# Altium project UZ_CarrierBoard.PrjPcb (part 1 of 10)
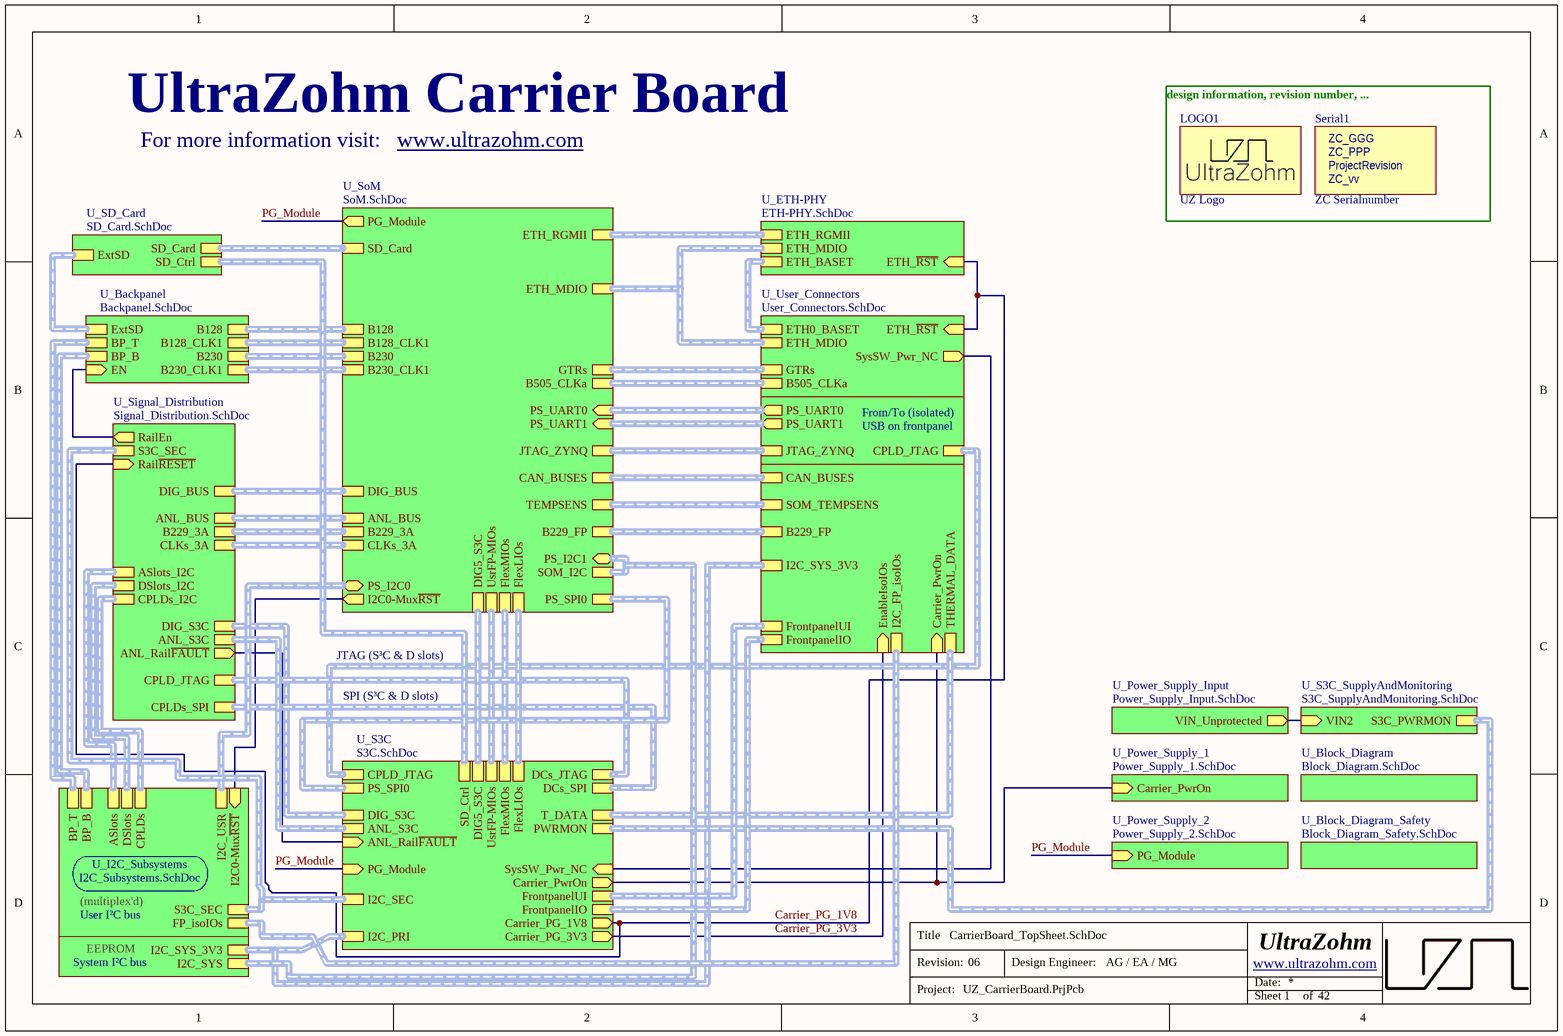
[diagram p0: CarrierBoard_TopSheet.SchDoc]
AuthorParam: AG / EA / MG; Project: UZ_CarrierBoard; ProjectDate: 07/2025; ProjectRevision: 06; Website: www.ultrazohm.com; SheetTotal: 42; Organization: UltraZohm; ZC_GGG: 00[12]; ZC_PPP: 001
42 sheets, 962 parts. Net scope: hierarchical (ports join the sheet entries above them; power ports are global).
Board file: UZ_CarrierBoard.PcbDoc
Sheets:
  CarrierBoard_TopSheet.SchDoc
    U_Signal_Distribution = Signal_Distribution.SchDoc
      DIG1 = Digital_Interface.SchDoc
        U_RP-SlotD = Rail_Protection_AD.SchDoc
      DIG2 = Digital_Interface.SchDoc
        U_RP-SlotD = Rail_Protection_AD.SchDoc
      DIG3 = Digital_Interface.SchDoc
        U_RP-SlotD = Rail_Protection_AD.SchDoc
      DIG4 = Digital_Interface.SchDoc
        U_RP-SlotD = Rail_Protection_AD.SchDoc
      DIG5 = Digital_Interface.SchDoc
        U_RP-SlotD = Rail_Protection_AD.SchDoc
      ANL1 = Analog_Interface.SchDoc
        U_RP-SlotA = Rail_Protection_AD.SchDoc
      ANL2 = Analog_Interface.SchDoc
        U_RP-SlotA = Rail_Protection_AD.SchDoc
      ANL3 = Analog_Interface.SchDoc
        U_RP-SlotA = Rail_Protection_AD.SchDoc
      U_GTH = GTH.SchDoc
      U_DIG_S3C_MCF = DIG_S3C_MultiChannelFunnel.SchDoc
      U_Rail_Shutdown_AD = Rail_Shutdown_AD.SchDoc
      U_ANL_P54_Buffer.SchDoc = ANL_P54_Buffer.SchDoc
    U_SoM = SoM.SchDoc
      U_J1 = J1-3xGTHQ_R+B66.SchDoc
      U_J2 = J2-1xGTHQ_L+1xGTHCLK+GTRQ+2xGTRCLK+4xPLLCLK+CFG+STAT.SchDoc
        U_J2_RefClkAndRTC = J2_RefClkAndRTC.SchDoc
      U_J3 = J3-3xGTHCLK+1xPLLCLK+MIO+B47+B48.SchDoc
      U_J4 = J4-B64+B65.SchDoc
    U_ETH-PHY = ETH-PHY.SchDoc
    U_SD_Card = SD_Card.SchDoc
    U_User_Connectors = User_Connectors.SchDoc
      U_isoDebug = isoDebug.SchDoc
        U_isoDebug-FTDI = isoDebug-FTDI.SchDoc
        U_isoDebug-Isolation = isoDebug-Isolation.SchDoc
      U_Frontpanel = Frontpanel.SchDoc
      U_Thermal = Thermal.SchDoc
      12V_FAN = Power_Supply_TPS54260.SchDoc
    U_Power_Supply_1 = Power_Supply_1.SchDoc
    U_Power_Supply_2 = Power_Supply_2.SchDoc
      1V8_PER = Power_Supply_TPS54260.SchDoc
      1V8_MOD = Power_Supply_TPS54260.SchDoc
    U_Power_Supply_Input = Power_Supply_Input.SchDoc
    U_Block_Diagram = Block_Diagram.SchDoc
    U_S3C = S3C.SchDoc
      U_S3C_IOs3V3 = S3C_IOs3V3.SchDoc
      U_S3C_IOs1V8 = S3C_IOs1V8.SchDoc
      U_S3C_SplitSPI = S3C_SplitSPI.SchDoc
      U_S3C_FrontpanelInterface = S3C_FrontpanelInterface.SchDoc
    U_Block_Diagram_Safety = Block_Diagram_Safety.SchDoc
    U_S3C_SupplyAndMonitoring = S3C_SupplyAndMonitoring.SchDoc
      3V3_S3C = Power_Supply_TPS54260.SchDoc
      U_PwrMon_VIN_10V = Power_Monitoring_TPS3803.SchDoc
      U_PwrMon_VIN_6V = Power_Monitoring_TPS3803.SchDoc
    U_I2C_Subsystems = I2C_Subsystems.SchDoc
      U_I2C0_Mux = I2C0_Mux.SchDoc
    U_Backpanel = Backpanel.SchDoc
      U_Backpanel2T = Backpanel_GigIO.SchDoc
        U_RP-BP = Rail_Protection_BP.SchDoc
      U_Backpanel1B = Backpanel_GigIO.SchDoc
        U_RP-BP = Rail_Protection_BP.SchDoc
      U_Backpanel_SwapMGT4 = Backpanel_SwapMGT4.SchDoc

## Sheet CarrierBoard_TopSheet.SchDoc
size A4; Author: AG / EA / MG; CompanyName: Technische Hochschule Nürnberg Georg Simon Ohm; Organization: UltraZohm; Address1: Kesslerplatz 12; Address2: 90489 Nürnberg; Address3: GERMANY; SheetNumber: 1; Website: www.ultrazohm.com

### Parts
LOGO1  UZ Logo  [UZ_Logo_small]  (no BOM)
Serial1  ZC Serialnumber  [ZC-Serial]  (no BOM)

### Sub-sheets
U_Backpanel = Backpanel.SchDoc: B128 (harness MGT4), B128_CLK1 (harness MGTCLK), B230 (harness MGT4), B230_CLK1 (harness MGTCLK), EN (in), BP_T (harness I2C), BP_B (harness I2C), ExtSD (harness ExtSD)
U_Block_Diagram = Block_Diagram.SchDoc: no entries
U_Block_Diagram_Safety = Block_Diagram_Safety.SchDoc: no entries
U_ETH-PHY = ETH-PHY.SchDoc: ETH_RGMII (harness ETH_RGMII), ETH_MDIO (harness ETH_MDIO), ETH_~{RST} (in), ETH_BASET (harness ETH_BASET)
U_I2C_Subsystems = I2C_Subsystems.SchDoc: I2C_USR (harness I2C), I2C_SYS (harness I2C), I2C_SYS_3V3 (harness I2C), CPLDs (harness I2C), DSlots (harness I2C), ASlots (harness I2C), S3C_SEC (harness I2C), FP_isoIOs (harness I2C), I2C0-Mux~{RST} (in), BP_T (harness I2C), BP_B (harness I2C)
U_Power_Supply_1 = Power_Supply_1.SchDoc: Carrier_PwrOn (in)
U_Power_Supply_2 = Power_Supply_2.SchDoc: PG_Module (in)
U_Power_Supply_Input = Power_Supply_Input.SchDoc: VIN_Unprotected (out)
U_S3C = S3C.SchDoc: DIG_S3C (harness DIG_S3C), PWRMON (harness S3C_PWRMON), CPLD_JTAG (harness JTAG), DCs_JTAG (harness JTAG), DCs_SPI (harness SPI_CPLDs), I2C_PRI (harness I2C), I2C_SEC (harness I2C), FrontpanelUI (harness FrontpanelUI), FlexMIOs (harness FlexMIOs), UsrFP-MIOs (harness UsrFP-MIOs), SysSW_Pwr_NC (in), T_DATA (harness T_DATA), ANL_S3C (harness ANL_S3C), SD_Ctrl (harness SD_Ctrl), PG_Module (in), Carrier_PwrOn (out), FrontpanelIO (harness FrontpanelIO), PS_SPI0 (harness SPI), DIG5_S3C (harness DIG5_S3C), FlexLIOs (harness FlexLIOs), Carrier_PG_3V3 (out), Carrier_PG_1V8 (out), ANL_Rail~{FAULT} (in)
U_S3C_SupplyAndMonitoring = S3C_SupplyAndMonitoring.SchDoc: VIN2 (in), S3C_PWRMON (harness S3C_PWRMON)
U_SD_Card = SD_Card.SchDoc: SD_Card (harness SD_Card), SD_Ctrl (harness SD_Ctrl), ExtSD (harness ExtSD)
U_Signal_Distribution = Signal_Distribution.SchDoc: DIG_BUS (harness DIG_BUS), ANL_BUS (harness ANL_BUS), CPLD_JTAG (harness JTAG), DSlots_I2C (harness I2C), ASlots_I2C (harness I2C), CPLDs_I2C (harness I2C), CPLDs_SPI (harness SPI_CPLDs), DIG_S3C (harness DIG_S3C), ANL_S3C (harness ANL_S3C), ANL_Rail~{FAULT} (out), B229_3A (harness MGT3), CLKs_3A (harness CLKs_3A), RailEn (out), Rail~{RESET} (in), S3C_SEC (harness I2C)
U_SoM = SoM.SchDoc: PS_UART1 (in, harness UART), PS_UART0 (in, harness UART), PS_I2C1 (bidir, harness I2C), PS_I2C0 (bidir, harness I2C), PG_Module (out), DIG_BUS (harness DIG_BUS), ETH_RGMII (harness ETH_RGMII), SD_Card (harness SD_Card), ANL_BUS (harness ANL_BUS), GTRs (harness GTRs), ETH_MDIO (harness ETH_MDIO), JTAG_ZYNQ (harness JTAG), PS_SPI0 (harness SPI), CAN_BUSES (harness CAN_BUSES), SOM_I2C (harness I2C), TEMPSENS (harness T_DIODE), UsrFP-MIOs (harness UsrFP-MIOs), FlexMIOs (harness FlexMIOs), B505_CLKa (harness MGTCLK), DIG5_S3C (harness DIG5_S3C), FlexLIOs (harness FlexLIOs), I2C0-Mux~{RST} (out), B229_3A (harness MGT3), CLKs_3A (harness CLKs_3A), B128 (harness MGT4), B128_CLK1 (harness MGTCLK), B230 (harness MGT4), B230_CLK1 (harness MGTCLK), B229_FP (harness GTH)
U_User_Connectors = User_Connectors.SchDoc: PS_UART0 (out, harness UART), PS_UART1 (out, harness UART), JTAG_ZYNQ (harness JTAG), CAN_BUSES (harness CAN_BUSES), CPLD_JTAG (harness JTAG), GTRs (harness GTRs), ETH0_BASET (harness ETH_BASET), ETH_MDIO (harness ETH_MDIO), SOM_TEMPSENS (harness T_DIODE), I2C_SYS_3V3 (harness I2C), FrontpanelUI (harness FrontpanelUI), SysSW_Pwr_NC (out), B505_CLKa (harness MGTCLK), THERMAL_DATA (harness T_DATA), FrontpanelIO (harness FrontpanelIO), ETH_~{RST} (in), EnableIsoIOs (in), I2C_FP_isoIOs (harness I2C), Carrier_PwrOn (in), B229_FP (harness GTH)

### Nets
ANL_Rail~{FAULT}: sheet U_Signal_Distribution/ANL_Rail~{FAULT}, sheet U_S3C/ANL_Rail~{FAULT}
Carrier_PG_1V8: sheet U_Signal_Distribution/Rail~{RESET}, sheet U_ETH-PHY/ETH_~{RST}, sheet U_User_Connectors/ETH_~{RST}, sheet U_S3C/Carrier_PG_1V8
Carrier_PG_3V3: sheet U_User_Connectors/EnableIsoIOs, sheet U_S3C/Carrier_PG_3V3
Carrier_PwrOn: sheet U_User_Connectors/Carrier_PwrOn, sheet U_Power_Supply_1/Carrier_PwrOn, sheet U_S3C/Carrier_PwrOn
I2C0-Mux~{RST}: sheet U_SoM/I2C0-Mux~{RST}, sheet U_I2C_Subsystems/I2C0-Mux~{RST}
PG_Module: sheet U_SoM/PG_Module, sheet U_Power_Supply_2/PG_Module, sheet U_S3C/PG_Module
RailEn: sheet U_Signal_Distribution/RailEn, sheet U_Backpanel/EN
SysSW_Pwr_NC: sheet U_User_Connectors/SysSW_Pwr_NC, sheet U_S3C/SysSW_Pwr_NC
VIN2: sheet U_Power_Supply_Input/VIN_Unprotected, sheet U_S3C_SupplyAndMonitoring/VIN2

### Buses and harness runs
harness sheet U_Backpanel/B128 = sheet U_SoM/B128
harness sheet U_Backpanel/B128_CLK1 = sheet U_SoM/B128_CLK1
harness sheet U_Backpanel/B230 = sheet U_SoM/B230
harness sheet U_Backpanel/B230_CLK1 = sheet U_SoM/B230_CLK1
harness sheet U_Backpanel/BP_B = sheet U_I2C_Subsystems/BP_B
harness sheet U_Backpanel/BP_T = sheet U_I2C_Subsystems/BP_T
harness sheet U_Backpanel/ExtSD = sheet U_SD_Card/ExtSD
harness sheet U_ETH-PHY/ETH_BASET = sheet U_User_Connectors/ETH0_BASET
harness sheet U_ETH-PHY/ETH_MDIO = sheet U_SoM/ETH_MDIO = sheet U_User_Connectors/ETH_MDIO
harness sheet U_ETH-PHY/ETH_RGMII = sheet U_SoM/ETH_RGMII
harness sheet U_I2C_Subsystems/ASlots = sheet U_Signal_Distribution/ASlots_I2C
harness sheet U_I2C_Subsystems/CPLDs = sheet U_Signal_Distribution/CPLDs_I2C
harness sheet U_I2C_Subsystems/DSlots = sheet U_Signal_Distribution/DSlots_I2C
harness sheet U_I2C_Subsystems/FP_isoIOs = sheet U_User_Connectors/I2C_FP_isoIOs
harness sheet U_I2C_Subsystems/I2C_SYS = sheet U_SoM/PS_I2C1 = sheet U_SoM/SOM_I2C
harness sheet U_I2C_Subsystems/I2C_SYS_3V3 = sheet U_S3C/I2C_PRI = sheet U_User_Connectors/I2C_SYS_3V3
harness sheet U_I2C_Subsystems/I2C_USR = sheet U_SoM/PS_I2C0
harness sheet U_I2C_Subsystems/S3C_SEC = sheet U_S3C/I2C_SEC = sheet U_Signal_Distribution/S3C_SEC
harness sheet U_S3C/ANL_S3C = sheet U_Signal_Distribution/ANL_S3C
harness sheet U_S3C/CPLD_JTAG = sheet U_User_Connectors/CPLD_JTAG
harness sheet U_S3C/DCs_JTAG = sheet U_Signal_Distribution/CPLD_JTAG
harness sheet U_S3C/DCs_SPI = sheet U_Signal_Distribution/CPLDs_SPI
harness sheet U_S3C/DIG5_S3C = sheet U_SoM/DIG5_S3C
harness sheet U_S3C/DIG_S3C = sheet U_Signal_Distribution/DIG_S3C
harness sheet U_S3C/FlexLIOs = sheet U_SoM/FlexLIOs
harness sheet U_S3C/FlexMIOs = sheet U_SoM/FlexMIOs
harness sheet U_S3C/FrontpanelIO = sheet U_User_Connectors/FrontpanelIO
harness sheet U_S3C/FrontpanelUI = sheet U_User_Connectors/FrontpanelUI
harness sheet U_S3C/PS_SPI0 = sheet U_SoM/PS_SPI0
harness sheet U_S3C/PWRMON = sheet U_S3C_SupplyAndMonitoring/S3C_PWRMON
harness sheet U_S3C/SD_Ctrl = sheet U_SD_Card/SD_Ctrl
harness sheet U_S3C/T_DATA = sheet U_User_Connectors/THERMAL_DATA
harness sheet U_S3C/UsrFP-MIOs = sheet U_SoM/UsrFP-MIOs
harness sheet U_SD_Card/SD_Card = sheet U_SoM/SD_Card
harness sheet U_Signal_Distribution/ANL_BUS = sheet U_SoM/ANL_BUS
harness sheet U_Signal_Distribution/B229_3A = sheet U_SoM/B229_3A
harness sheet U_Signal_Distribution/CLKs_3A = sheet U_SoM/CLKs_3A
harness sheet U_Signal_Distribution/DIG_BUS = sheet U_SoM/DIG_BUS
harness sheet U_SoM/B229_FP = sheet U_User_Connectors/B229_FP
harness sheet U_SoM/B505_CLKa = sheet U_User_Connectors/B505_CLKa
harness sheet U_SoM/CAN_BUSES = sheet U_User_Connectors/CAN_BUSES
harness sheet U_SoM/GTRs = sheet U_User_Connectors/GTRs
harness sheet U_SoM/JTAG_ZYNQ = sheet U_User_Connectors/JTAG_ZYNQ
harness sheet U_SoM/PS_UART0 = sheet U_User_Connectors/PS_UART0
harness sheet U_SoM/PS_UART1 = sheet U_User_Connectors/PS_UART1
harness sheet U_SoM/TEMPSENS = sheet U_User_Connectors/SOM_TEMPSENS

### Notes on the sheet
- UltraZohm Carrier Board
- For more information visit:
- www.ultrazohm.com <https://www.ultrazohm.com>
- (near Serial1) design information, revision number, ...
- From/To (isolated)
- USB on frontpanel
- JTAG (S³C & D slots)
- SPI (S³C & D slots)
- (multiplex'd)
- User I²C bus
- System I²C bus
- EEPROM
- Title
- Revision:
- Design Engineer:
- Date:
- Project:
- Sheet
- of
- (in symbol ZC-Serial) ZC_GGG; ZC_PPP; ProjectRevision; ZC_vv

### Library data of the parts
LOGO1 = UZ Logo: UltraZohm Logo on PCB; Created: Jan2021_Liegmann; Value: UZ Logo
Serial1 = ZC-Serial: Manufacturer: UltraZohm; Value: GGG-PPP-VVvv; Created from: FRosner; Manufacturer Part Number: ZC-Serial; PartID: 58; Created On: 15/04/2025 09:17:14; ComponentLink1Description: https://docs.ultrazohm.com/; ComponentLink1URL: homepage; Component Type: ZC Serialnumber; Last Updated: 15/04/2025 09:17:14; Supplier 1: -; Supplier Part Number 1: -; Type: Serial Number; Live Cycle Status: 1

## Sheet Signal_Distribution.SchDoc
size A4; Author: AG / EA / MG; CompanyName: Technische Hochschule Nürnberg Georg Simon Ohm; Organization: UltraZohm; Address1: Kesslerplatz 12; Address2: 90489 Nürnberg; Address3: GERMANY; SheetNumber: 16; Website: www.ultrazohm.com
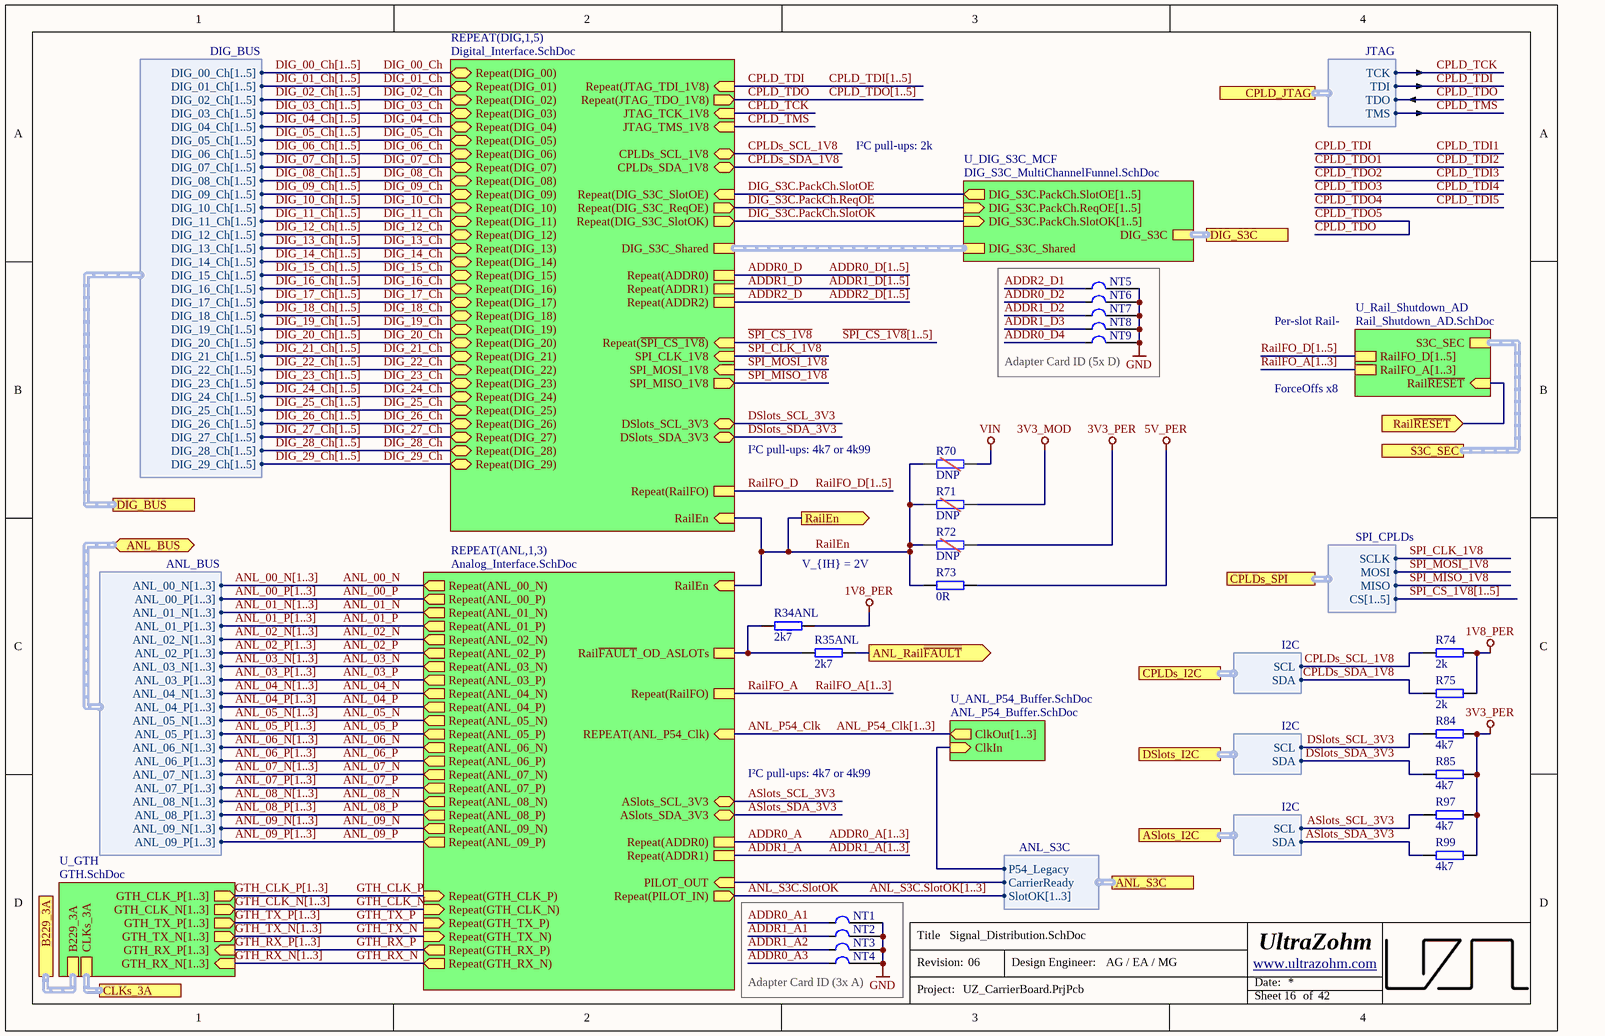
[diagram p1: Signal_Distribution.SchDoc]

### Parts
NT1  Net Tie 1 to 1  [1_to_1_NetTie_0.1mm]  (value not drawn)  (net tie, no BOM)
NT2  Net Tie 1 to 1  [1_to_1_NetTie_0.1mm]  (value not drawn)  (net tie, no BOM)
NT3  Net Tie 1 to 1  [1_to_1_NetTie_0.1mm]  (value not drawn)  (net tie, no BOM)
NT4  Net Tie 1 to 1  [1_to_1_NetTie_0.1mm]  (value not drawn)  (net tie, no BOM)
NT5  Net Tie 1 to 1  [1_to_1_NetTie_0.1mm]  (value not drawn)  (net tie, no BOM)
NT6  Net Tie 1 to 1  [1_to_1_NetTie_0.1mm]  (value not drawn)  (net tie, no BOM)
NT7  Net Tie 1 to 1  [1_to_1_NetTie_0.1mm]  (value not drawn)  (net tie, no BOM)
NT8  Net Tie 1 to 1  [1_to_1_NetTie_0.1mm]  (value not drawn)  (net tie, no BOM)
NT9  Net Tie 1 to 1  [1_to_1_NetTie_0.1mm]  (value not drawn)  (net tie, no BOM)
R34ANL  2k7  [R_0603_TE]
R35ANL  2k7  [R_0603_TE]
R70  DNP  [R_1206_TE-DNP]  (no BOM)
R71  DNP  [R_1206_TE-DNP]  (no BOM)
R72  DNP  [R_1206_TE-DNP]  (no BOM)
R73  0R  [R_1206_TE]
R74  2k  [R_0603_TE]
R75  2k  [R_0603_TE]
R84  4k7  [R_0603_TE]
R85  4k7  [R_0603_TE]
R97  4k7  [R_0603_TE]
R99  4k7  [R_0603_TE]

### Blocks framed on the sheet
Adapter Card ID (5x D): NT5-NT9
Adapter Card ID (3x A): NT1-NT4

### Sub-sheets
REPEAT(ANL,1,3) = Analog_Interface.SchDoc: Repeat(ANL_05_N) (out), Repeat(ANL_07_N) (out), Repeat(ANL_02_N) (out), Repeat(ANL_06_N) (out), Repeat(ANL_08_P) (out), Repeat(ANL_07_P) (out), Repeat(ANL_02_P) (out), Repeat(ANL_01_P) (out), Repeat(ANL_01_N) (out), Repeat(ANL_04_N) (out), Repeat(ANL_05_P) (out), Repeat(ANL_06_P) (out), Repeat(ANL_03_P) (out), Repeat(ANL_03_N) (out), Repeat(ANL_04_P) (out), Repeat(ANL_08_N) (out), PILOT_OUT (in), Repeat(ANL_00_P) (out), Repeat(ANL_09_P) (out), Repeat(PILOT_IN) (out), Repeat(ANL_09_N) (out), Repeat(ANL_00_N) (out), ASlots_SCL_3V3 (bidir), ASlots_SDA_3V3 (bidir), Repeat(GTH_CLK_P) (in), Repeat(GTH_CLK_N) (in), Repeat(GTH_TX_N) (in), Repeat(GTH_TX_P) (in), Repeat(GTH_RX_N) (out), Repeat(GTH_RX_P) (out), RailEn (in), Repeat(ADDR0), Repeat(ADDR1), REPEAT(ANL_P54_Clk) (in), Rail~{FAULT}_OD_ASLOTs, Repeat(RailFO)
REPEAT(DIG,1,5) = Digital_Interface.SchDoc: Repeat(DIG_01) (bidir), Repeat(DIG_03) (bidir), Repeat(DIG_05) (bidir), Repeat(DIG_07) (bidir), Repeat(DIG_09) (bidir), Repeat(DIG_11) (bidir), Repeat(DIG_13) (bidir), Repeat(DIG_15) (bidir), Repeat(DIG_17) (bidir), Repeat(DIG_19) (bidir), Repeat(DIG_21) (bidir), Repeat(DIG_23) (bidir), Repeat(DIG_25) (bidir), Repeat(DIG_27) (bidir), Repeat(DIG_29) (bidir), Repeat(DIG_02) (bidir), Repeat(DIG_04) (bidir), Repeat(DIG_06) (bidir), Repeat(DIG_08) (bidir), Repeat(DIG_10) (bidir), Repeat(DIG_12) (bidir), Repeat(DIG_14) (bidir), Repeat(DIG_16) (bidir), Repeat(DIG_18) (bidir), Repeat(DIG_20) (bidir), Repeat(DIG_22) (bidir), Repeat(DIG_24) (bidir), Repeat(DIG_26) (bidir), Repeat(DIG_28) (bidir), Repeat(DIG_00) (bidir), JTAG_TCK_1V8 (in), JTAG_TMS_1V8 (in), Repeat(JTAG_TDI_1V8) (in), Repeat(JTAG_TDO_1V8) (out), DSlots_SDA_3V3 (bidir), DSlots_SCL_3V3 (bidir), CPLDs_SDA_1V8 (bidir), CPLDs_SCL_1V8 (bidir), DIG_S3C_Shared (harness DIG_S3C_Shared), Repeat(DIG_S3C_SlotOE) (in), Repeat(DIG_S3C_ReqOE) (out), Repeat(~{SPI_CS_1V8}) (in), SPI_CLK_1V8 (in), SPI_MOSI_1V8 (in), SPI_MISO_1V8 (out), Repeat(DIG_S3C_SlotOK) (out), RailEn (in), Repeat(ADDR0), Repeat(ADDR1), Repeat(ADDR2), Repeat(RailFO)
U_ANL_P54_Buffer.SchDoc = ANL_P54_Buffer.SchDoc: ClkOut[1..3] (out), ClkIn (in)
U_DIG_S3C_MCF = DIG_S3C_MultiChannelFunnel.SchDoc: DIG_S3C (harness DIG_S3C), DIG_S3C_Shared (harness DIG_S3C_Shared), DIG_S3C.PackCh.SlotOE[1..5] (out), DIG_S3C.PackCh.ReqOE[1..5] (in), DIG_S3C.PackCh.SlotOK[1..5] (in)
U_GTH = GTH.SchDoc: GTH_CLK_P[1..3] (out), GTH_CLK_N[1..3] (out), GTH_TX_P[1..3] (out), GTH_TX_N[1..3] (out), GTH_RX_P[1..3] (in), GTH_RX_N[1..3] (in), B229_3A (harness MGT3), CLKs_3A (harness CLKs_3A)
U_Rail_Shutdown_AD = Rail_Shutdown_AD.SchDoc: S3C_SEC (harness I2C), Rail~{RESET} (in), RailFO_D[1..5], RailFO_A[1..3]

### Ports
ANL_BUS (bidir, harness ANL_BUS), ANL_Rail~{FAULT} (out), ANL_S3C (harness ANL_S3C), ASlots_I2C (harness I2C), B229_3A (harness MGT3), CLKs_3A (harness CLKs_3A), CPLD_JTAG (harness JTAG), CPLDs_I2C (harness I2C), CPLDs_SPI (harness SPI_CPLDs), DIG_BUS (harness DIG_BUS), DIG_S3C (harness DIG_S3C), DSlots_I2C (harness I2C), RailEn (out), Rail~{RESET} (in), S3C_SEC (harness I2C)

### Harnesses
DIG_BUS: DIG_01_Ch[1..5], DIG_02_Ch[1..5], DIG_03_Ch[1..5], DIG_04_Ch[1..5], DIG_05_Ch[1..5], DIG_06_Ch[1..5], DIG_07_Ch[1..5], DIG_08_Ch[1..5], DIG_09_Ch[1..5], DIG_10_Ch[1..5], DIG_11_Ch[1..5], DIG_12_Ch[1..5], DIG_13_Ch[1..5], DIG_14_Ch[1..5], DIG_15_Ch[1..5], DIG_16_Ch[1..5], DIG_17_Ch[1..5], DIG_18_Ch[1..5], DIG_19_Ch[1..5], DIG_20_Ch[1..5], DIG_21_Ch[1..5], DIG_22_Ch[1..5], DIG_23_Ch[1..5], DIG_24_Ch[1..5], DIG_25_Ch[1..5], DIG_26_Ch[1..5], DIG_27_Ch[1..5], DIG_28_Ch[1..5], DIG_29_Ch[1..5], DIG_00_Ch[1..5]
ANL_BUS: ANL_00_N[1..3], ANL_00_P[1..3], ANL_01_N[1..3], ANL_01_P[1..3], ANL_02_N[1..3], ANL_02_P[1..3], ANL_03_N[1..3], ANL_03_P[1..3], ANL_04_N[1..3], ANL_04_P[1..3], ANL_05_N[1..3], ANL_05_P[1..3], ANL_06_N[1..3], ANL_06_P[1..3], ANL_07_N[1..3], ANL_07_P[1..3], ANL_08_N[1..3], ANL_08_P[1..3], ANL_09_N[1..3], ANL_09_P[1..3]
I2C: SCL, SDA
SPI_CPLDs: SCLK, MOSI, MISO, CS[1..5]
JTAG: TCK, TDI, TDO, TMS
ANL_S3C: CarrierReady, SlotOK[1..3], P54_Legacy

### Nets
1V8_PER: R34ANL.2 R74.2 R75.2
3V3_MOD: R71.2
3V3_PER: R72.2 R84.2 R85.2 R97.2 R99.2
5V_PER: R73.2
GND: NT1.2 NT2.2 NT3.2 NT4.2 NT5.2 NT6.2 NT7.2 NT8.2 NT9.2
VIN: R70.2
ADDR0_A: sheet REPEAT(ANL,1,3)/Repeat(ADDR0)
ADDR0_A1: NT1.1  [project net ADDR0]
ADDR0_A3: NT4.1  [project net ADDR0]
ADDR0_D: sheet REPEAT(DIG,1,5)/Repeat(ADDR0)
ADDR0_D2: NT6.1
ADDR0_D4: NT9.1
ADDR1_A: sheet REPEAT(ANL,1,3)/Repeat(ADDR1)
ADDR1_A1: NT2.1  [project net ADDR1]
ADDR1_A2: NT3.1  [project net ADDR1]
ADDR1_D: sheet REPEAT(DIG,1,5)/Repeat(ADDR1)
ADDR1_D2: NT7.1
ADDR1_D3: NT8.1
ADDR2_D: sheet REPEAT(DIG,1,5)/Repeat(ADDR2)
ADDR2_D1: NT5.1
ANL_00_N: sheet REPEAT(ANL,1,3)/Repeat(ANL_00_N)
ANL_00_P: sheet REPEAT(ANL,1,3)/Repeat(ANL_00_P)
ANL_01_N: sheet REPEAT(ANL,1,3)/Repeat(ANL_01_N)
ANL_01_P: sheet REPEAT(ANL,1,3)/Repeat(ANL_01_P)
ANL_02_N: sheet REPEAT(ANL,1,3)/Repeat(ANL_02_N)
ANL_02_P: sheet REPEAT(ANL,1,3)/Repeat(ANL_02_P)
ANL_03_N: sheet REPEAT(ANL,1,3)/Repeat(ANL_03_N)
ANL_03_P: sheet REPEAT(ANL,1,3)/Repeat(ANL_03_P)
ANL_04_N: sheet REPEAT(ANL,1,3)/Repeat(ANL_04_N)
ANL_04_P: sheet REPEAT(ANL,1,3)/Repeat(ANL_04_P)
ANL_05_N: sheet REPEAT(ANL,1,3)/Repeat(ANL_05_N)
ANL_05_P: sheet REPEAT(ANL,1,3)/Repeat(ANL_05_P)
ANL_06_N: sheet REPEAT(ANL,1,3)/Repeat(ANL_06_N)
ANL_06_P: sheet REPEAT(ANL,1,3)/Repeat(ANL_06_P)
ANL_07_N: sheet REPEAT(ANL,1,3)/Repeat(ANL_07_N)
ANL_07_P: sheet REPEAT(ANL,1,3)/Repeat(ANL_07_P)
ANL_08_N: sheet REPEAT(ANL,1,3)/Repeat(ANL_08_N)
ANL_08_P: sheet REPEAT(ANL,1,3)/Repeat(ANL_08_P)
ANL_09_N: sheet REPEAT(ANL,1,3)/Repeat(ANL_09_N)
ANL_09_P: sheet REPEAT(ANL,1,3)/Repeat(ANL_09_P)
ANL_P54_Clk: sheet REPEAT(ANL,1,3)/REPEAT(ANL_P54_Clk)
ANL_Rail~{FAULT}: R35ANL.2 ; port ANL_Rail~{FAULT}
ANL_S3C.CarrierReady: sheet REPEAT(ANL,1,3)/PILOT_OUT, port ANL_S3C.CarrierReady
ANL_S3C.P54_Legacy: sheet U_ANL_P54_Buffer.SchDoc/ClkIn, port ANL_S3C.P54_Legacy
ANL_S3C.SlotOK: sheet REPEAT(ANL,1,3)/Repeat(PILOT_IN)
ASlots_SCL_3V3: R97.1 ; sheet REPEAT(ANL,1,3)/ASlots_SCL_3V3, port ASlots_I2C.SCL
ASlots_SDA_3V3: R99.1 ; sheet REPEAT(ANL,1,3)/ASlots_SDA_3V3, port ASlots_I2C.SDA
Carrier_PG_1V8: port Rail~{RESET}, sheet U_Rail_Shutdown_AD/Rail~{RESET}
CPLD_TCK: sheet REPEAT(DIG,1,5)/JTAG_TCK_1V8, port CPLD_JTAG.TCK
CPLD_TDI: sheet REPEAT(DIG,1,5)/Repeat(JTAG_TDI_1V8), port CPLD_JTAG.TDI  [also labelled CPLD_TDI1]
CPLD_TDO: sheet REPEAT(DIG,1,5)/Repeat(JTAG_TDO_1V8), port CPLD_JTAG.TDO  [also labelled CPLD_TDO5]
CPLD_TMS: sheet REPEAT(DIG,1,5)/JTAG_TMS_1V8, port CPLD_JTAG.TMS
CPLDs_SCL_1V8: R74.1 ; sheet REPEAT(DIG,1,5)/CPLDs_SCL_1V8, port CPLDs_I2C.SCL
CPLDs_SDA_1V8: R75.1 ; sheet REPEAT(DIG,1,5)/CPLDs_SDA_1V8, port CPLDs_I2C.SDA
DIG_00_Ch: sheet REPEAT(DIG,1,5)/Repeat(DIG_00)
DIG_01_Ch: sheet REPEAT(DIG,1,5)/Repeat(DIG_01)
DIG_02_Ch: sheet REPEAT(DIG,1,5)/Repeat(DIG_02)
DIG_03_Ch: sheet REPEAT(DIG,1,5)/Repeat(DIG_03)
DIG_04_Ch: sheet REPEAT(DIG,1,5)/Repeat(DIG_04)
DIG_05_Ch: sheet REPEAT(DIG,1,5)/Repeat(DIG_05)
DIG_06_Ch: sheet REPEAT(DIG,1,5)/Repeat(DIG_06)
DIG_07_Ch: sheet REPEAT(DIG,1,5)/Repeat(DIG_07)
DIG_08_Ch: sheet REPEAT(DIG,1,5)/Repeat(DIG_08)
DIG_09_Ch: sheet REPEAT(DIG,1,5)/Repeat(DIG_09)
DIG_10_Ch: sheet REPEAT(DIG,1,5)/Repeat(DIG_10)
DIG_11_Ch: sheet REPEAT(DIG,1,5)/Repeat(DIG_11)
DIG_12_Ch: sheet REPEAT(DIG,1,5)/Repeat(DIG_12)
DIG_13_Ch: sheet REPEAT(DIG,1,5)/Repeat(DIG_13)
DIG_14_Ch: sheet REPEAT(DIG,1,5)/Repeat(DIG_14)
DIG_15_Ch: sheet REPEAT(DIG,1,5)/Repeat(DIG_15)
DIG_16_Ch: sheet REPEAT(DIG,1,5)/Repeat(DIG_16)
DIG_17_Ch: sheet REPEAT(DIG,1,5)/Repeat(DIG_17)
DIG_18_Ch: sheet REPEAT(DIG,1,5)/Repeat(DIG_18)
DIG_19_Ch: sheet REPEAT(DIG,1,5)/Repeat(DIG_19)
DIG_20_Ch: sheet REPEAT(DIG,1,5)/Repeat(DIG_20)
DIG_21_Ch: sheet REPEAT(DIG,1,5)/Repeat(DIG_21)
DIG_22_Ch: sheet REPEAT(DIG,1,5)/Repeat(DIG_22)
DIG_23_Ch: sheet REPEAT(DIG,1,5)/Repeat(DIG_23)
DIG_24_Ch: sheet REPEAT(DIG,1,5)/Repeat(DIG_24)
DIG_25_Ch: sheet REPEAT(DIG,1,5)/Repeat(DIG_25)
DIG_26_Ch: sheet REPEAT(DIG,1,5)/Repeat(DIG_26)
DIG_27_Ch: sheet REPEAT(DIG,1,5)/Repeat(DIG_27)
DIG_28_Ch: sheet REPEAT(DIG,1,5)/Repeat(DIG_28)
DIG_29_Ch: sheet REPEAT(DIG,1,5)/Repeat(DIG_29)
DIG_S3C.PackCh.ReqOE: sheet REPEAT(DIG,1,5)/Repeat(DIG_S3C_ReqOE)
DIG_S3C.PackCh.SlotOE: sheet REPEAT(DIG,1,5)/Repeat(DIG_S3C_SlotOE)
DIG_S3C.PackCh.SlotOK: sheet REPEAT(DIG,1,5)/Repeat(DIG_S3C_SlotOK)
DSlots_SCL_3V3: R84.1 ; sheet REPEAT(DIG,1,5)/DSlots_SCL_3V3, port DSlots_I2C.SCL
DSlots_SDA_3V3: R85.1 ; sheet REPEAT(DIG,1,5)/DSlots_SDA_3V3, port DSlots_I2C.SDA
~{FAULT}_OD-: R34ANL.1 R35ANL.1 ; sheet REPEAT(ANL,1,3)/Rail~{FAULT}_OD_ASLOTs
GTH_CLK_N: sheet REPEAT(ANL,1,3)/Repeat(GTH_CLK_N)
GTH_CLK_P: sheet REPEAT(ANL,1,3)/Repeat(GTH_CLK_P)
GTH_RX_N: sheet REPEAT(ANL,1,3)/Repeat(GTH_RX_N)
GTH_RX_P: sheet REPEAT(ANL,1,3)/Repeat(GTH_RX_P)
GTH_TX_N: sheet REPEAT(ANL,1,3)/Repeat(GTH_TX_N)
GTH_TX_P: sheet REPEAT(ANL,1,3)/Repeat(GTH_TX_P)
RailEn: R70.1 R71.1 R72.1 R73.1 ; port RailEn, sheet REPEAT(DIG,1,5)/RailEn, sheet REPEAT(ANL,1,3)/RailEn
RailFO_A: sheet REPEAT(ANL,1,3)/Repeat(RailFO)
RailFO_D: sheet REPEAT(DIG,1,5)/Repeat(RailFO)
~{SPI_CS_1V8}: sheet REPEAT(DIG,1,5)/Repeat(~{SPI_CS_1V8})
SPI_CLK_1V8: sheet REPEAT(DIG,1,5)/SPI_CLK_1V8, port CPLDs_SPI.SCLK  [project net PS_SPI0.CLK]
SPI_MISO_1V8: sheet REPEAT(DIG,1,5)/SPI_MISO_1V8, port CPLDs_SPI.MISO  [project net PS_SPI0.MISO]
SPI_MOSI_1V8: sheet REPEAT(DIG,1,5)/SPI_MOSI_1V8, port CPLDs_SPI.MOSI  [project net PS_SPI0.MOSI]

### Buses and harness runs
bus ADDR0_A[1..3]
bus ADDR0_D[1..5]
bus ADDR1_A[1..3]
bus ADDR1_D[1..5]
bus ADDR2_D[1..5]
bus ANL_00_N[1..3]
bus ANL_00_P[1..3]
bus ANL_01_N[1..3]
bus ANL_01_P[1..3]
bus ANL_02_N[1..3]
bus ANL_02_P[1..3]
bus ANL_03_N[1..3]
bus ANL_03_P[1..3]
bus ANL_04_N[1..3]
bus ANL_04_P[1..3]
bus ANL_05_N[1..3]
bus ANL_05_P[1..3]
bus ANL_06_N[1..3]
bus ANL_06_P[1..3]
bus ANL_07_N[1..3]
bus ANL_07_P[1..3]
bus ANL_08_N[1..3]
bus ANL_08_P[1..3]
bus ANL_09_N[1..3]
bus ANL_09_P[1..3]
bus ANL_P54_Clk[1..3] = sheet U_ANL_P54_Buffer.SchDoc/ClkOut[1..3]
bus ANL_S3C.SlotOK[1..3]
bus CPLD_TDI[1..5]
bus CPLD_TDO[1..5]
bus DIG_00_Ch[1..5]
bus DIG_01_Ch[1..5]
bus DIG_02_Ch[1..5]
bus DIG_03_Ch[1..5]
bus DIG_04_Ch[1..5]
bus DIG_05_Ch[1..5]
bus DIG_06_Ch[1..5]
bus DIG_07_Ch[1..5]
bus DIG_08_Ch[1..5]
bus DIG_09_Ch[1..5]
bus DIG_10_Ch[1..5]
bus DIG_11_Ch[1..5]
bus DIG_12_Ch[1..5]
bus DIG_13_Ch[1..5]
bus DIG_14_Ch[1..5]
bus DIG_15_Ch[1..5]
bus DIG_16_Ch[1..5]
bus DIG_17_Ch[1..5]
bus DIG_18_Ch[1..5]
bus DIG_19_Ch[1..5]
bus DIG_20_Ch[1..5]
bus DIG_21_Ch[1..5]
bus DIG_22_Ch[1..5]
bus DIG_23_Ch[1..5]
bus DIG_24_Ch[1..5]
bus DIG_25_Ch[1..5]
bus DIG_26_Ch[1..5]
bus DIG_27_Ch[1..5]
bus DIG_28_Ch[1..5]
bus DIG_29_Ch[1..5]
bus GTH_CLK_N[1..3] = sheet U_GTH/GTH_CLK_N[1..3]
bus GTH_CLK_P[1..3] = sheet U_GTH/GTH_CLK_P[1..3]
bus GTH_RX_N[1..3] = sheet U_GTH/GTH_RX_N[1..3]
bus GTH_RX_P[1..3] = sheet U_GTH/GTH_RX_P[1..3]
bus GTH_TX_N[1..3] = sheet U_GTH/GTH_TX_N[1..3]
bus GTH_TX_P[1..3] = sheet U_GTH/GTH_TX_P[1..3]
bus RailFO_A[1..3]
bus RailFO_A[1..3] = sheet U_Rail_Shutdown_AD/RailFO_A[1..3]
bus RailFO_D[1..5]
bus RailFO_D[1..5] = sheet U_Rail_Shutdown_AD/RailFO_D[1..5]
bus ~{SPI_CS_1V8}[1..5]
harness port B229_3A = sheet U_GTH/B229_3A
harness port CLKs_3A = sheet U_GTH/CLKs_3A
harness port DIG_S3C = sheet U_DIG_S3C_MCF/DIG_S3C
harness port S3C_SEC = sheet U_Rail_Shutdown_AD/S3C_SEC
harness sheet REPEAT(DIG,1,5)/DIG_S3C_Shared = sheet U_DIG_S3C_MCF/DIG_S3C_Shared

### Notes on the sheet
- I²C pull-ups: 2k
- Per-slot Rail-
- ForceOffs x8
- I²C pull-ups: 4k7 or 4k99
- V_{IH} = 2V
- Title
- Revision:
- Design Engineer:
- Date:
- Project:
- Sheet
- of

### Library data of the parts
NT1-NT9 = Net Tie 1 to 1: Net Tie 1 to 1. Joins two nets without producing a DRC error or renaming one of the nets; PartID: 2; Created On: 29/09/2024 15:25:00; Component Type: Net Tie 1 to 1; Last Updated: 29/09/2024 15:25:00; Type: Net Tie (No BOM); Created by: MGeier; Live Cycle Status: 1
R34ANL R35ANL = UZgen_R_0603_2k7: Generic resistor; Manufacturer: UZgen; Tolerance: 1 %; Created from: UZgenTool; Manufacturer Part Number: UZgen_R_0603_2k7; PartID: 231; Created On: 02/07/2024 17:29:49; Value: 2k7; Device Package: 0603; Mounting Type: SMD; Last Updated: 02/07/2024 17:29:49
R70-R72 = UZgen_R_1206_DNP: Generic resistor (DNP); Manufacturer: UZgen; Created from: UZgenTool; Manufacturer Part Number: UZgen_R_1206_DNP; PartID: 595; Created On: 25/03/2025 14:26:15; Value: DNP; Device Package: 1206; Tolerance: -; Mounting Type: SMD; Last Updated: 02/04/2025 19:05:00
R73 = UZgen_R_1206_0R: Generic resistor; Manufacturer: UZgen; Tolerance: 1 %; Created from: UZgenTool; Manufacturer Part Number: UZgen_R_1206_0R; PartID: 583; Created On: 08/07/2024 14:34:30; Value: 0R; Device Package: 1206; Mounting Type: SMD; Last Updated: 08/07/2024 14:34:30
R74 R75 = UZgen_R_0603_2k: Generic resistor; Manufacturer: UZgen; Tolerance: 1 %; Created from: UZgenTool; Manufacturer Part Number: UZgen_R_0603_2k; PartID: 228; Created On: 02/07/2024 17:29:49; Value: 2k; Device Package: 0603; Mounting Type: SMD; Last Updated: 02/07/2024 17:29:49
R84 R85 R97 R99 = UZgen_R_0603_4k7: Generic resistor; Manufacturer: UZgen; Tolerance: 1 %; Created from: UZgenTool; Manufacturer Part Number: UZgen_R_0603_4k7; PartID: 237; Created On: 02/07/2024 17:29:50; Value: 4k7; Device Package: 0603; Mounting Type: SMD; Last Updated: 02/07/2024 17:29:50

## Sheet Digital_Interface.SchDoc
size A3; Author: AG / EA / MG; CompanyName: Technische Hochschule Nürnberg Georg Simon Ohm; Organization: UltraZohm; Address1: Kesslerplatz 12; Address2: 90489 Nürnberg; Address3: GERMANY; SheetNumber: 21; Website: www.ultrazohm.com
Used 5 times, as channels U_Signal_Distribution/DIG1, U_Signal_Distribution/DIG2, U_Signal_Distribution/DIG3, U_Signal_Distribution/DIG4, U_Signal_Distribution/DIG5. Parts and nets are listed once, with the designators drawn on the sheet.
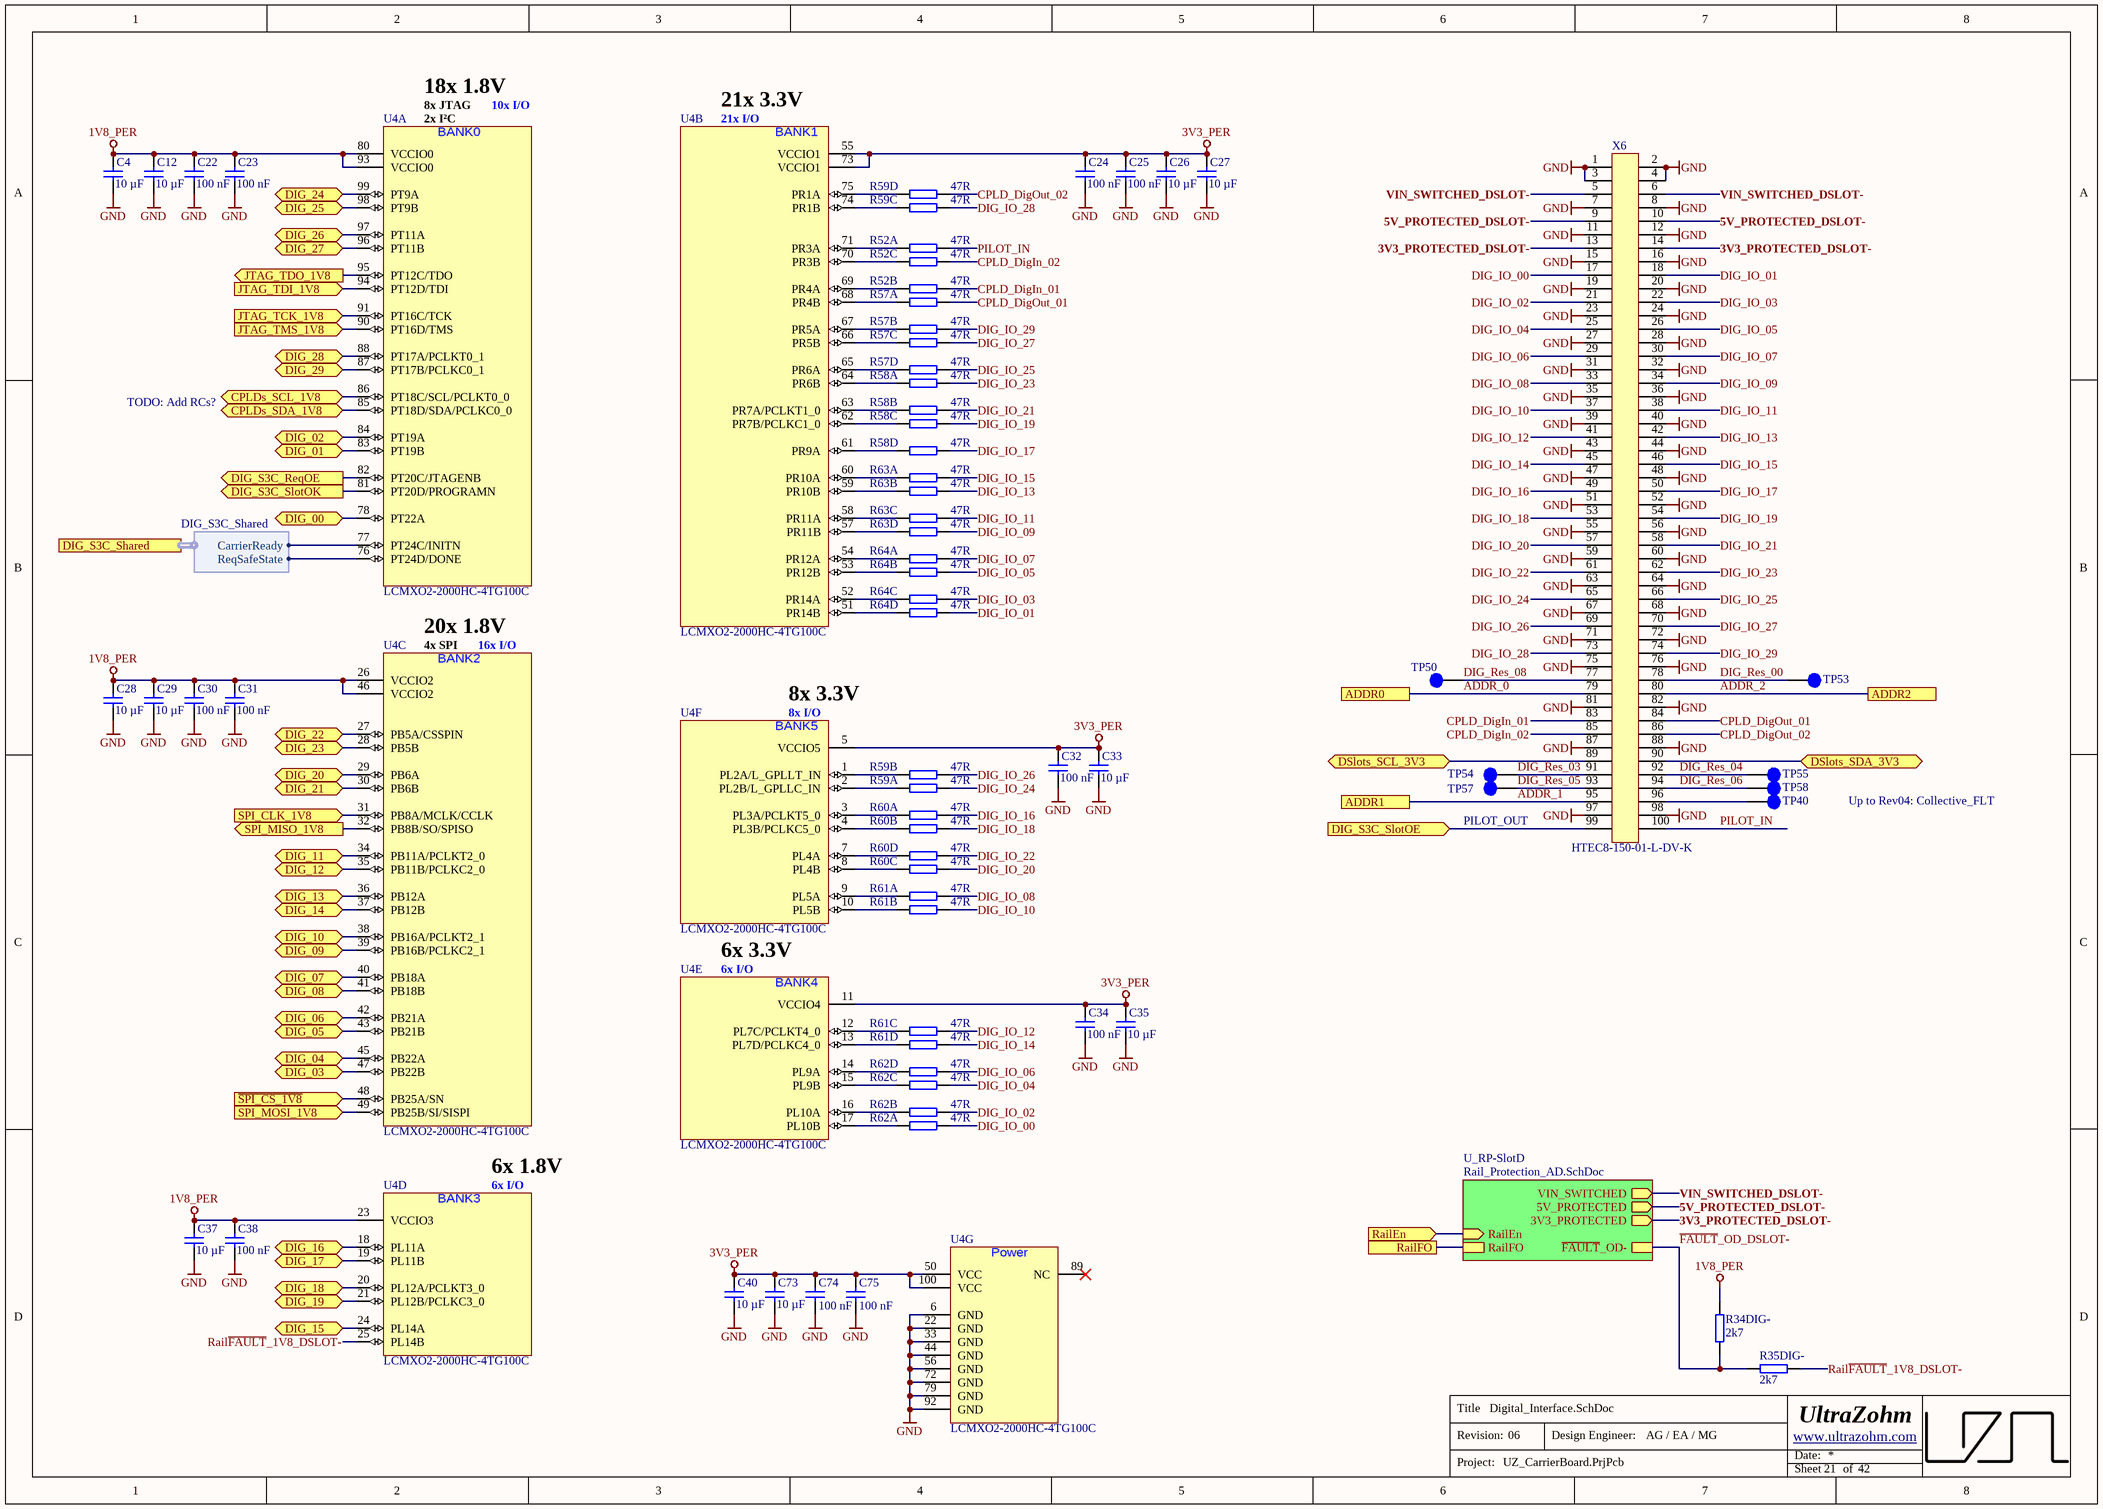
[diagram p2: Digital_Interface.SchDoc]

### Parts
C4  10 µF  [C_0603_TE]
C12  10 µF  [C_0603_TE]
C22  100 nF  [C_0603_TE]
C23  100 nF  [C_0603_TE]
C24  100 nF  [C_0603_TE]
C25  100 nF  [C_0603_TE]
C26  10 µF  [C_0603_TE]
C27  10 µF  [C_0603_TE]
C28  10 µF  [C_0603_TE]
C29  10 µF  [C_0603_TE]
C30  100 nF  [C_0603_TE]
C31  100 nF  [C_0603_TE]
C32  100 nF  [C_0603_TE]
C33  10 µF  [C_0603_TE]
C34  100 nF  [C_0603_TE]
C35  10 µF  [C_0603_TE]
C37  10 µF  [C_0603_TE]
C38  100 nF  [C_0603_TE]
C40  10 µF  [C_0603_TE]
C73  10 µF  [C_0603_TE]
C74  100 nF  [C_0603_TE]
C75  100 nF  [C_0603_TE]
R34DIG-  2k7  [R_0603_TE]
R35DIG-  2k7  [R_0603_TE]
R52  47R  [RESCAV80P160X320X70-8N]  (parts A,B,C of 4)
R57  47R  [RESCAV80P160X320X70-8N]  (parts A,B,C,D of 4)
R58  47R  [RESCAV80P160X320X70-8N]  (parts A,B,C,D of 4)
R59  47R  [RESCAV80P160X320X70-8N]  (parts A,B,C,D of 4)
R60  47R  [RESCAV80P160X320X70-8N]  (parts A,B,C,D of 4)
R61  47R  [RESCAV80P160X320X70-8N]  (parts A,B,C,D of 4)
R62  47R  [RESCAV80P160X320X70-8N]  (parts A,B,C,D of 4)
R63  47R  [RESCAV80P160X320X70-8N]  (parts A,B,C,D of 4)
R64  47R  [RESCAV80P160X320X70-8N]  (parts A,B,C,D of 4)
TP40  Testpoint 1mm  [TP_1mm]  (value not drawn)  (no BOM)
TP50  Testpoint 1mm  [TP_1mm]  (value not drawn)  (no BOM)
TP53  Testpoint 1mm  [TP_1mm]  (value not drawn)  (no BOM)
TP54  Testpoint 1mm  [TP_1mm]  (value not drawn)  (no BOM)
TP55  Testpoint 1mm  [TP_1mm]  (value not drawn)  (no BOM)
TP57  Testpoint 1mm  [TP_1mm]  (value not drawn)  (no BOM)
TP58  Testpoint 1mm  [TP_1mm]  (value not drawn)  (no BOM)
U4  LCMXO2-2000HC-4TG100C  [QFP50P1600X1600X160-100N]  (parts A,B,C,D,E,F,G of 7)
X6  HTEC8-150-01-L-DV-K  [HTEC8-150-XX-X-DV]

### Sub-sheets
U_RP-SlotD = Rail_Protection_AD.SchDoc: RailEn (in), VIN_SWITCHED (out), ~{FAULT}_OD-, 5V_PROTECTED (out), 3V3_PROTECTED (out), RailFO

### Ports
ADDR0, ADDR1, ADDR2, CPLDs_SCL_1V8 (bidir), CPLDs_SDA_1V8 (bidir), DIG_00 (bidir), DIG_01 (bidir), DIG_02 (bidir), DIG_03 (bidir), DIG_04 (bidir), DIG_05 (bidir), DIG_06 (bidir), DIG_07 (bidir), DIG_08 (bidir), DIG_09 (bidir), DIG_10 (bidir), DIG_11 (bidir), DIG_12 (bidir), DIG_13 (bidir), DIG_14 (bidir), DIG_15 (bidir), DIG_16 (bidir), DIG_17 (bidir), DIG_18 (bidir), DIG_19 (bidir), DIG_20 (bidir), DIG_21 (bidir), DIG_22 (bidir), DIG_23 (bidir), DIG_24 (bidir), DIG_25 (bidir), DIG_26 (bidir), DIG_27 (bidir), DIG_28 (bidir), DIG_29 (bidir), DIG_S3C_ReqOE (out), DIG_S3C_Shared (harness DIG_S3C_Shared), DIG_S3C_SlotOE (in), DIG_S3C_SlotOK (out), DSlots_SCL_3V3 (bidir), DSlots_SDA_3V3 (bidir), JTAG_TCK_1V8 (in), JTAG_TDI_1V8 (in), JTAG_TDO_1V8 (out), JTAG_TMS_1V8 (in), RailEn (in), RailFO, SPI_CLK_1V8 (in), SPI_MISO_1V8 (out), SPI_MOSI_1V8 (in), ~{SPI_CS_1V8} (in)

### Harnesses
DIG_S3C_Shared: CarrierReady, ReqSafeState

### Nets
1V8_PER: C4.1 C12.1 C22.2 C23.2 C28.1 C29.1 C30.2 C31.2 C37.1 C38.2 R34DIG-.2 U4.23(VCCIO3) U4.26(VCCIO2) U4.46(VCCIO2) U4.80(VCCIO0) U4.93(VCCIO0)
3V3_PER: C24.2 C25.2 C26.1 C27.1 C32.2 C33.1 C34.2 C35.1 C40.1 C73.1 C74.2 C75.2 U4.5(VCCIO5) U4.11(VCCIO4) U4.50(VCC) U4.55(VCCIO1) U4.73(VCCIO1) U4.100(VCC)
GND: C4.2 C12.2 C22.1 C23.1 C24.1 C25.1 C26.2 C27.2 C28.2 C29.2 C30.1 C31.1 C32.1 C33.2 C34.1 C35.2 C37.2 C38.1 C40.2 C73.2 C74.1 C75.1 U4.6(GND) U4.22(GND) U4.33(GND) U4.44(GND) U4.56(GND) U4.72(GND) U4.79(GND) U4.92(GND) X6.1 X6.2 X6.3 X6.4 X6.7 X6.8 X6.11 X6.12 X6.15 X6.16 X6.19 X6.20 X6.23 X6.24 X6.27 X6.28 X6.31 X6.32 X6.35 X6.36 X6.39 X6.40 X6.43 X6.44 X6.47 X6.48 X6.51 X6.52 X6.55 X6.56 X6.59 X6.60 X6.63 X6.64 X6.67 X6.68 X6.71 X6.72 X6.75 X6.76 X6.81 X6.82 X6.87 X6.88 X6.97 X6.98
3V3_PROTECTED_DSLOT-: X6.13 X6.14 ; sheet U_RP-SlotD/3V3_PROTECTED
5V_PROTECTED_DSLOT-: X6.9 X6.10 ; sheet U_RP-SlotD/5V_PROTECTED
ADDR_0: X6.79 ; port ADDR0
ADDR_1: X6.95 ; port ADDR1
ADDR_2: X6.80 ; port ADDR2
CPLD_DigIn_01: R52.7 X6.83
CPLD_DigIn_02: R52.6 X6.85
CPLD_DigOut_01: R57.8 X6.84
CPLD_DigOut_02: R59.5 X6.86
CPLDs_SCL_1V8: U4.86(PT18C/SCL/PCLKT0_0) ; port CPLDs_SCL_1V8
CPLDs_SDA_1V8: U4.85(PT18D/SDA/PCLKC0_0) ; port CPLDs_SDA_1V8
DIG_00: U4.78(PT22A) ; port DIG_00
DIG_01: U4.83(PT19B) ; port DIG_01
DIG_02: U4.84(PT19A) ; port DIG_02
DIG_03: U4.47(PB22B) ; port DIG_03
DIG_04: U4.45(PB22A) ; port DIG_04
DIG_05: U4.43(PB21B) ; port DIG_05
DIG_06: U4.42(PB21A) ; port DIG_06
DIG_07: U4.40(PB18A) ; port DIG_07
DIG_08: U4.41(PB18B) ; port DIG_08
DIG_09: U4.39(PB16B/PCLKC2_1) ; port DIG_09
DIG_10: U4.38(PB16A/PCLKT2_1) ; port DIG_10
DIG_11: U4.34(PB11A/PCLKT2_0) ; port DIG_11
DIG_12: U4.35(PB11B/PCLKC2_0) ; port DIG_12
DIG_13: U4.36(PB12A) ; port DIG_13
DIG_14: U4.37(PB12B) ; port DIG_14
DIG_15: U4.24(PL14A) ; port DIG_15
DIG_16: U4.18(PL11A) ; port DIG_16
DIG_17: U4.19(PL11B) ; port DIG_17
DIG_18: U4.20(PL12A/PCLKT3_0) ; port DIG_18
DIG_19: U4.21(PL12B/PCLKC3_0) ; port DIG_19
DIG_20: U4.29(PB6A) ; port DIG_20
DIG_21: U4.30(PB6B) ; port DIG_21
DIG_22: U4.27(PB5A/CSSPIN) ; port DIG_22
DIG_23: U4.28(PB5B) ; port DIG_23
DIG_24: U4.99(PT9A) ; port DIG_24
DIG_25: U4.98(PT9B) ; port DIG_25
DIG_26: U4.97(PT11A) ; port DIG_26
DIG_27: U4.96(PT11B) ; port DIG_27
DIG_28: U4.88(PT17A/PCLKT0_1) ; port DIG_28
DIG_29: U4.87(PT17B/PCLKC0_1) ; port DIG_29
DIG_IO_00: R62.8 X6.17
DIG_IO_01: R64.5 X6.18
DIG_IO_02: R62.7 X6.21
DIG_IO_03: R64.6 X6.22
DIG_IO_04: R62.6 X6.25
DIG_IO_05: R64.7 X6.26
DIG_IO_06: R62.5 X6.29
DIG_IO_07: R64.8 X6.30
DIG_IO_08: R61.8 X6.33
DIG_IO_09: R63.5 X6.34
DIG_IO_10: R61.7 X6.37
DIG_IO_11: R63.6 X6.38
DIG_IO_12: R61.6 X6.41
DIG_IO_13: R63.7 X6.42
DIG_IO_14: R61.5 X6.45
DIG_IO_15: R63.8 X6.46
DIG_IO_16: R60.8 X6.49
DIG_IO_17: R58.5 X6.50
DIG_IO_18: R60.7 X6.53
DIG_IO_19: R58.6 X6.54
DIG_IO_20: R60.6 X6.57
DIG_IO_21: R58.7 X6.58
DIG_IO_22: R60.5 X6.61
DIG_IO_23: R58.8 X6.62
DIG_IO_24: R59.8 X6.65
DIG_IO_25: R57.5 X6.66
DIG_IO_26: R59.7 X6.69
DIG_IO_27: R57.6 X6.70
DIG_IO_28: R59.6 X6.73
DIG_IO_29: R57.7 X6.74
DIG_Res_00: TP53.1 X6.78
DIG_Res_03: TP54.1 X6.91
DIG_Res_04: TP55.1 X6.92
DIG_Res_05: TP57.1 X6.93
DIG_Res_06: TP58.1 X6.94
DIG_Res_08: TP50.1 X6.77
DIG_S3C_ReqOE: U4.82(PT20C/JTAGENB) ; port DIG_S3C_ReqOE
DIG_S3C_SlotOE: X6.99 ; port DIG_S3C_SlotOE
DIG_S3C_SlotOK: U4.81(PT20D/PROGRAMN) ; port DIG_S3C_SlotOK
DSlots_SCL_3V3: X6.89 ; port DSlots_SCL_3V3
DSlots_SDA_3V3: X6.90 ; port DSlots_SDA_3V3
~{FAULT}_OD_DSLOT-: R34DIG-.1 R35DIG-.1 ; sheet U_RP-SlotD/~{FAULT}_OD-
JTAG_TCK_1V8: U4.91(PT16C/TCK) ; port JTAG_TCK_1V8
JTAG_TDI_1V8: U4.94(PT12D/TDI) ; port JTAG_TDI_1V8
JTAG_TDO_1V8: U4.95(PT12C/TDO) ; port JTAG_TDO_1V8
JTAG_TMS_1V8: U4.90(PT16D/TMS) ; port JTAG_TMS_1V8
PILOT_IN: R52.8 X6.100
RailEn: port RailEn, sheet U_RP-SlotD/RailEn
Rail~{FAULT}_1V8_DSLOT-: R35DIG-.2 U4.25(PL14B)
RailFO: port RailFO, sheet U_RP-SlotD/RailFO
~{SPI_CS_1V8}: U4.48(PB25A/SN) ; port ~{SPI_CS_1V8}
SPI_CLK_1V8: U4.31(PB8A/MCLK/CCLK) ; port SPI_CLK_1V8
SPI_MISO_1V8: U4.32(PB8B/SO/SPISO) ; port SPI_MISO_1V8
SPI_MOSI_1V8: U4.49(PB25B/SI/SISPI) ; port SPI_MOSI_1V8
VIN_SWITCHED_DSLOT-: X6.5 X6.6 ; sheet U_RP-SlotD/VIN_SWITCHED
NetR52_1: R52.1 U4.71(PR3A)
NetR52_2: R52.2 U4.69(PR4A)
NetR52_3: R52.3 U4.70(PR3B)
NetR57_1: R57.1 U4.68(PR4B)
NetR57_2: R57.2 U4.67(PR5A)
NetR57_3: R57.3 U4.66(PR5B)
NetR57_4: R57.4 U4.65(PR6A)
NetR58_1: R58.1 U4.64(PR6B)
NetR58_2: R58.2 U4.63(PR7A/PCLKT1_0)
NetR58_3: R58.3 U4.62(PR7B/PCLKC1_0)
NetR58_4: R58.4 U4.61(PR9A)
NetR59_1: R59.1 U4.2(PL2B/L_GPLLC_IN)
NetR59_2: R59.2 U4.1(PL2A/L_GPLLT_IN)
NetR59_3: R59.3 U4.74(PR1B)
NetR59_4: R59.4 U4.75(PR1A)
NetR60_1: R60.1 U4.3(PL3A/PCLKT5_0)
NetR60_2: R60.2 U4.4(PL3B/PCLKC5_0)
NetR60_3: R60.3 U4.8(PL4B)
NetR60_4: R60.4 U4.7(PL4A)
NetR61_1: R61.1 U4.9(PL5A)
NetR61_2: R61.2 U4.10(PL5B)
NetR61_3: R61.3 U4.12(PL7C/PCLKT4_0)
NetR61_4: R61.4 U4.13(PL7D/PCLKC4_0)
NetR62_1: R62.1 U4.17(PL10B)
NetR62_2: R62.2 U4.16(PL10A)
NetR62_3: R62.3 U4.15(PL9B)
NetR62_4: R62.4 U4.14(PL9A)
NetR63_1: R63.1 U4.60(PR10A)
NetR63_2: R63.2 U4.59(PR10B)
NetR63_3: R63.3 U4.58(PR11A)
NetR63_4: R63.4 U4.57(PR11B)
NetR64_1: R64.1 U4.54(PR12A)
NetR64_2: R64.2 U4.53(PR12B)
NetR64_3: R64.3 U4.52(PR14A)
NetR64_4: R64.4 U4.51(PR14B)
NetTP40_1: TP40.1 X6.96
NetU4_76: U4.76(PT24D/DONE) ; port DIG_S3C_Shared.ReqSafeState
NetU4_77: U4.77(PT24C/INITN) ; port DIG_S3C_Shared.CarrierReady

Not connected (* = marked no-connect by the designer): U4 89(NC)*

### Channels
U_Signal_Distribution/DIG1: designators end in A; ports ADDR0=ADDR0_D1 ADDR1=ADDR1_D1 ADDR2=ADDR2_D1 CPLDs_SCL_1V8=CPLDs_SCL_1V8 CPLDs_SDA_1V8=CPLDs_SDA_1V8 DIG_00=B65_L7_N DIG_01=B65_L7_P DIG_02=B65_L6_N DIG_03=B65_L6_P DIG_04=B64_L5_P DIG_05=B64_L5_N DIG_06=B65_L10_N DIG_07=B65_L10_P DIG_08=B65_L9_N DIG_09=B65_L9_P DIG_10=B65_L4_N DIG_11=B65_L4_P DIG_12=B65_L14_N DIG_13=B65_L14_P DIG_14=B65_L8_P DIG_15=B65_L8_N DIG_16=B65_L2_N DIG_17=B65_L2_P DIG_18=B65_L3_N DIG_19=B65_L3_P DIG_20=B65_L1_P DIG_21=B65_L1_N DIG_22=B65_L5_P DIG_23=B65_L5_N DIG_24=B64_L24_N DIG_25=B64_L24_P DIG_26=B65_L19_N DIG_27=B65_L19_P DIG_28=B65_L15_N DIG_29=B65_L15_P DIG_S3C_ReqOE=DIG_S3C.PackCh.ReqOE1 DIG_S3C_SlotOE=DIG_S3C.PackCh.SlotOE1 DIG_S3C_SlotOK=DIG_S3C.PackCh.SlotOK1 DSlots_SCL_3V3=DSlots_SCL_3V3 DSlots_SDA_3V3=DSlots_SDA_3V3 JTAG_TCK_1V8=CPLD_TCK JTAG_TDI_1V8=CPLD_TDI JTAG_TDO_1V8=CPLD_TDI2 JTAG_TMS_1V8=CPLD_TMS RailEn=RailEn RailFO=RailFO_D1 SPI_CLK_1V8=PS_SPI0.CLK SPI_MISO_1V8=PS_SPI0.MISO SPI_MOSI_1V8=PS_SPI0.MOSI ~{SPI_CS_1V8}=~{SPI_CS_1V8}1
U_Signal_Distribution/DIG2: designators end in B; ports ADDR0=ADDR0_D2 ADDR1=ADDR1_D2 ADDR2=ADDR2_D2 CPLDs_SCL_1V8=CPLDs_SCL_1V8 CPLDs_SDA_1V8=CPLDs_SDA_1V8 DIG_00=DIG_00_Ch2 DIG_01=DIG_01_Ch2 DIG_02=DIG_02_Ch2 DIG_03=DIG_03_Ch2 DIG_04=DIG_04_Ch2 DIG_05=DIG_05_Ch2 DIG_06=DIG_06_Ch2 DIG_07=DIG_07_Ch2 DIG_08=DIG_08_Ch2 DIG_09=DIG_09_Ch2 DIG_10=DIG_10_Ch2 DIG_11=DIG_11_Ch2 DIG_12=DIG_12_Ch2 DIG_13=DIG_13_Ch2 DIG_14=B65_T3 DIG_15=B65_T2 DIG_16=B65_T1 DIG_17=B65_T0 DIG_18=B65_L24_P DIG_19=B65_L24_N DIG_20=B65_L22_P DIG_21=B65_L22_N DIG_22=B65_L23_N DIG_23=B65_L23_P DIG_24=DIG_24_Ch2 DIG_25=DIG_25_Ch2 DIG_26=DIG_26_Ch2 DIG_27=DIG_27_Ch2 DIG_28=DIG_28_Ch2 DIG_29=DIG_29_Ch2 DIG_S3C_ReqOE=DIG_S3C.PackCh.ReqOE2 DIG_S3C_SlotOE=DIG_S3C.PackCh.SlotOE2 DIG_S3C_SlotOK=DIG_S3C.PackCh.SlotOK2 DSlots_SCL_3V3=DSlots_SCL_3V3 DSlots_SDA_3V3=DSlots_SDA_3V3 JTAG_TCK_1V8=CPLD_TCK JTAG_TDI_1V8=CPLD_TDI2 JTAG_TDO_1V8=CPLD_TDI3 JTAG_TMS_1V8=CPLD_TMS RailEn=RailEn RailFO=RailFO_D2 SPI_CLK_1V8=PS_SPI0.CLK SPI_MISO_1V8=PS_SPI0.MISO SPI_MOSI_1V8=PS_SPI0.MOSI ~{SPI_CS_1V8}=~{SPI_CS_1V8}2
U_Signal_Distribution/DIG3: designators end in C; ports ADDR0=ADDR0_D3 ADDR1=ADDR1_D3 ADDR2=ADDR2_D3 CPLDs_SCL_1V8=CPLDs_SCL_1V8 CPLDs_SDA_1V8=CPLDs_SDA_1V8 DIG_00=DIG_00_Ch3 DIG_01=DIG_01_Ch3 DIG_02=DIG_02_Ch3 DIG_03=DIG_03_Ch3 DIG_04=DIG_04_Ch3 DIG_05=DIG_05_Ch3 DIG_06=DIG_06_Ch3 DIG_07=DIG_07_Ch3 DIG_08=DIG_08_Ch3 DIG_09=DIG_09_Ch3 DIG_10=DIG_10_Ch3 DIG_11=DIG_11_Ch3 DIG_12=DIG_12_Ch3 DIG_13=DIG_13_Ch3 DIG_14=DIG_14_Ch3 DIG_15=DIG_15_Ch3 DIG_16=DIG_16_Ch3 DIG_17=DIG_17_Ch3 DIG_18=DIG_18_Ch3 DIG_19=DIG_19_Ch3 DIG_20=DIG_20_Ch3 DIG_21=DIG_21_Ch3 DIG_22=DIG_22_Ch3 DIG_23=DIG_23_Ch3 DIG_24=DIG_24_Ch3 DIG_25=DIG_25_Ch3 DIG_26=DIG_26_Ch3 DIG_27=DIG_27_Ch3 DIG_28=DIG_28_Ch3 DIG_29=DIG_29_Ch3 DIG_S3C_ReqOE=DIG_S3C.PackCh.ReqOE3 DIG_S3C_SlotOE=DIG_S3C.PackCh.SlotOE3 DIG_S3C_SlotOK=DIG_S3C.PackCh.SlotOK3 DSlots_SCL_3V3=DSlots_SCL_3V3 DSlots_SDA_3V3=DSlots_SDA_3V3 JTAG_TCK_1V8=CPLD_TCK JTAG_TDI_1V8=CPLD_TDI3 JTAG_TDO_1V8=CPLD_TDI4 JTAG_TMS_1V8=CPLD_TMS RailEn=RailEn RailFO=RailFO_D3 SPI_CLK_1V8=PS_SPI0.CLK SPI_MISO_1V8=PS_SPI0.MISO SPI_MOSI_1V8=PS_SPI0.MOSI ~{SPI_CS_1V8}=~{SPI_CS_1V8}3
U_Signal_Distribution/DIG4: designators end in D; ports ADDR0=ADDR0_D4 ADDR1=ADDR1_D4 ADDR2=ADDR2_D4 CPLDs_SCL_1V8=CPLDs_SCL_1V8 CPLDs_SDA_1V8=CPLDs_SDA_1V8 DIG_00=DIG_00_Ch4 DIG_01=DIG_01_Ch4 DIG_02=DIG_02_Ch4 DIG_03=DIG_03_Ch4 DIG_04=DIG_04_Ch4 DIG_05=DIG_05_Ch4 DIG_06=DIG_06_Ch4 DIG_07=DIG_07_Ch4 DIG_08=DIG_08_Ch4 DIG_09=DIG_09_Ch4 DIG_10=DIG_10_Ch4 DIG_11=DIG_11_Ch4 DIG_12=DIG_12_Ch4 DIG_13=DIG_13_Ch4 DIG_14=DIG_14_Ch4 DIG_15=DIG_15_Ch4 DIG_16=DIG_16_Ch4 DIG_17=DIG_17_Ch4 DIG_18=DIG_18_Ch4 DIG_19=DIG_19_Ch4 DIG_20=DIG_20_Ch4 DIG_21=DIG_21_Ch4 DIG_22=DIG_22_Ch4 DIG_23=DIG_23_Ch4 DIG_24=DIG_24_Ch4 DIG_25=DIG_25_Ch4 DIG_26=DIG_26_Ch4 DIG_27=DIG_27_Ch4 DIG_28=DIG_28_Ch4 DIG_29=DIG_29_Ch4 DIG_S3C_ReqOE=DIG_S3C.PackCh.ReqOE4 DIG_S3C_SlotOE=DIG_S3C.PackCh.SlotOE4 DIG_S3C_SlotOK=DIG_S3C.PackCh.SlotOK4 DSlots_SCL_3V3=DSlots_SCL_3V3 DSlots_SDA_3V3=DSlots_SDA_3V3 JTAG_TCK_1V8=CPLD_TCK JTAG_TDI_1V8=CPLD_TDI4 JTAG_TDO_1V8=CPLD_TDI5 JTAG_TMS_1V8=CPLD_TMS RailEn=RailEn RailFO=RailFO_D4 SPI_CLK_1V8=PS_SPI0.CLK SPI_MISO_1V8=PS_SPI0.MISO SPI_MOSI_1V8=PS_SPI0.MOSI ~{SPI_CS_1V8}=~{SPI_CS_1V8}4
U_Signal_Distribution/DIG5: designators end in E; ports ADDR0=ADDR0_D5 ADDR1=ADDR1_D5 ADDR2=ADDR2_D5 CPLDs_SCL_1V8=CPLDs_SCL_1V8 CPLDs_SDA_1V8=CPLDs_SDA_1V8 DIG_00=DIG_00_Ch5 DIG_01=DIG_01_Ch5 DIG_02=DIG_02_Ch5 DIG_03=DIG_03_Ch5 DIG_04=DIG_04_Ch5 DIG_05=DIG_05_Ch5 DIG_06=DIG_06_Ch5 DIG_07=DIG_07_Ch5 DIG_08=DIG_08_Ch5 DIG_09=DIG_09_Ch5 DIG_10=DIG_10_Ch5 DIG_11=DIG_11_Ch5 DIG_12=DIG_12_Ch5 DIG_13=DIG_13_Ch5 DIG_14=DIG_14_Ch5 DIG_15=DIG_15_Ch5 DIG_16=DIG_16_Ch5 DIG_17=DIG_17_Ch5 DIG_18=DIG_18_Ch5 DIG_19=DIG_19_Ch5 DIG_20=DIG_20_Ch5 DIG_21=DIG_21_Ch5 DIG_22=DIG_22_Ch5 DIG_23=DIG_23_Ch5 DIG_24=DIG_24_Ch5 DIG_25=DIG_25_Ch5 DIG_26=DIG_26_Ch5 DIG_27=DIG_27_Ch5 DIG_28=DIG_28_Ch5 DIG_29=DIG_29_Ch5 DIG_S3C_ReqOE=DIG_S3C.PackCh.ReqOE5 DIG_S3C_SlotOE=DIG_S3C.PackCh.SlotOE5 DIG_S3C_SlotOK=DIG_S3C.PackCh.SlotOK5 DSlots_SCL_3V3=DSlots_SCL_3V3 DSlots_SDA_3V3=DSlots_SDA_3V3 JTAG_TCK_1V8=CPLD_TCK JTAG_TDI_1V8=CPLD_TDI5 JTAG_TDO_1V8=CPLD_TDO JTAG_TMS_1V8=CPLD_TMS RailEn=RailEn RailFO=RailFO_D5 SPI_CLK_1V8=PS_SPI0.CLK SPI_MISO_1V8=PS_SPI0.MISO SPI_MOSI_1V8=PS_SPI0.MOSI ~{SPI_CS_1V8}=~{SPI_CS_1V8}5

### Notes on the sheet
- 18x 1.8V
- 8x JTAG
- 10x I/O
- (near U4) 21x 3.3V
- (near U4) 2x I²C
- 21x I/O
- TODO: Add RCs?
- 20x 1.8V
- (near U4) 4x SPI
- 16x I/O
- 8x 3.3V
- (near U4) 8x I/O
- PILOT_OUT
- Up to Rev04: Collective_FLT
- (near U4) 6x 3.3V
- 6x I/O
- (near U4) 6x 1.8V
- Title
- Revision:
- Design Engineer:
- Date:
- Project:
- Sheet
- of
- (in symbol LCMXO2-2000HC-4TG100C, part A) BANK0
- (in symbol LCMXO2-2000HC-4TG100C, part B) BANK1
- (in symbol LCMXO2-2000HC-4TG100C, part C) BANK2
- (in symbol LCMXO2-2000HC-4TG100C, part D) BANK3
- (in symbol LCMXO2-2000HC-4TG100C, part E) BANK4
- (in symbol LCMXO2-2000HC-4TG100C, part F) BANK5
- (in symbol LCMXO2-2000HC-4TG100C, part G) Power

### Library data of the parts
C4 C12 C26-C29 C33 C35 C37 C40 C73 = UZgen_C_0603_10uF_6.3V_X7R: Generic capacitor; Manufacturer: UZgen; Voltage: 6.3V; Tolerance: 10 %; Created from: UZgenTool; Manufacturer Part Number: UZgen_C_0603_10uF_6.3V_X7R; PartID: 3631; Created On: 02.08.2024 11:17:55; Value: 10 µF; Device Package: 0603; Technology: X7R; Mounting Type: SMD; Last Updated: 02.08.2024 11:17:55
C22-C25 C30-C32 C34 C38 C74 C75 = UZgen_C_0603_100nF_50V_X7R: Generic capacitor; Manufacturer: UZgen; Tolerance: 10 %; Voltage: 50 V; Created from: AGeiger; Value: 100 nF; Technology: X7R; Manufacturer Part Number: UZgen_C_0603_100nF_50V_X7R; PartID: 1; Created On: 02/07/2024 14:42:23; Device Package: 0603; Mounting Type: SMD; Last Updated: 02/08/2024 14:45:57
R34DIG- R35DIG- = UZgen_R_0603_2k7: as R34ANL on sheet Signal_Distribution; Manufacturer Part Number: UZgen_R_0603_2k7; PartID: 231; Created On: 02/07/2024 17:29:49; Value: 2k7; Device Package: 0603; Mounting Type: SMD; Last Updated: 02/07/2024 17:29:49
R52 R57-R64 = CAY16-470J4LF: Resistor Networks & Arrays 47ohm 5% Convex 4resistors; Manufacturer: Bourns; Created from: AGeiger; Manufacturer Part Number: CAY16-470J4LF; PartID: 342; Created On: 06.08.2024 10:26:57; ComponentLink1Description: Datasheet; ComponentLink1URL: https://www.mouser.de/datasheet/2/54/CATCAY-777361.pdf; Component Type: SMD resistor array; Device Package: 1206; Last Updated: 06.08.2024 10:26:57; Mounting Type: SMD; Supplier 1: Mouser; Supplier Part Number 1: 652-CAY16-470J4LF; Supplier 2: LCSC; Supplier Part Number 2: C16081; Type: Resistor Array; Tolerance: 5%; Value: 47R; Live Cycle Status: 1; Stock number: not stored; LCSC Part Number: C16081
TP40 TP50 TP53-TP55 TP57 TP58 = NULL: Manufacturer Part Number: NULL; Created from: AGeiger; Created: 2018_06_25_AGeiger; Value: Testpoint 1mm; PartID: 9; Component Type: Testpoint; Manufacturer: NULL; Supplier 1: NULL; Supplier Part Number 1: NULL; Type: Testpoint; Live Cycle Status: 1
  TP40: Created On: 20/09/2022 13:14:57; Last Updated: 20/09/2022 13:15:39
  TP50 TP53-TP55 TP57 TP58: Created On: 20.09.2022 13:14:57; Last Updated: 20.09.2022 13:15:39
U4 = LCMXO2-2000HC-4TG100C: TQFP-100(14x14) Programmable Logic Device (CPLDs/FPGAs) ROHS; Manufacturer: Lattice; Created from: FRosner; Manufacturer Part Number: LCMXO2-2000HC-4TG100C; PartID: 37; Created On: 03.07.2024 17:33:36; ComponentLink1Description: Datasheet; ComponentLink1URL: https://wmsc.lcsc.com/wmsc/upload/file/pdf/v2/lcsc/2403111456_Lattice-LCMXO2-2000HC-4TG100C_C1521632.pdf; Component Type: CPLD; Device Package: SMD; Last Updated: 03.07.2024 17:33:36; Mounting Type: SMD; Operating Temperature: -0°C - +85°C; Supplier 1: LCSC; Supplier Part Number 1: C1521632; Supplier 2: Mouser; Supplier Part Number 2: 842-XO22000HC4TG100C; Type: CPLD; Live Cycle Status: 1; LCSC Part Number: C1521632; Stock number: not stored
X6 = HTEC8-150-01-L-DV-K: HTEC8-150-01-L-DV-K mating connector for card layout; Manufacturer: SAMTEC; Created from: MGremer; Number of positions: 100; Manufacturer Part Number: HTEC8-150-01-L-DV-K; PartID: 7; Created On: 26.02.2021 16:36:12; ComponentLink1Description: Homepage; ComponentLink1URL: https://www.samtec.com/de/products/htec8-150-01-l-dv; Component Type: Board to Board Connector; Device Package: SMD; Last Updated: 09.07.2024 10:19:13; Mounting Type: SMD; Series: HTEC; Supplier 1: SAMTEC; Supplier Part Number 1: HTEC8-150-01-L-DV-K; Type: Board to Board Connector; Live Cycle Status: 1; LCSC Part Number: C20365621; Stock number: not stored; Number of rows: 2